# Altium schematic sheet Legendre.SchDoc
size A4
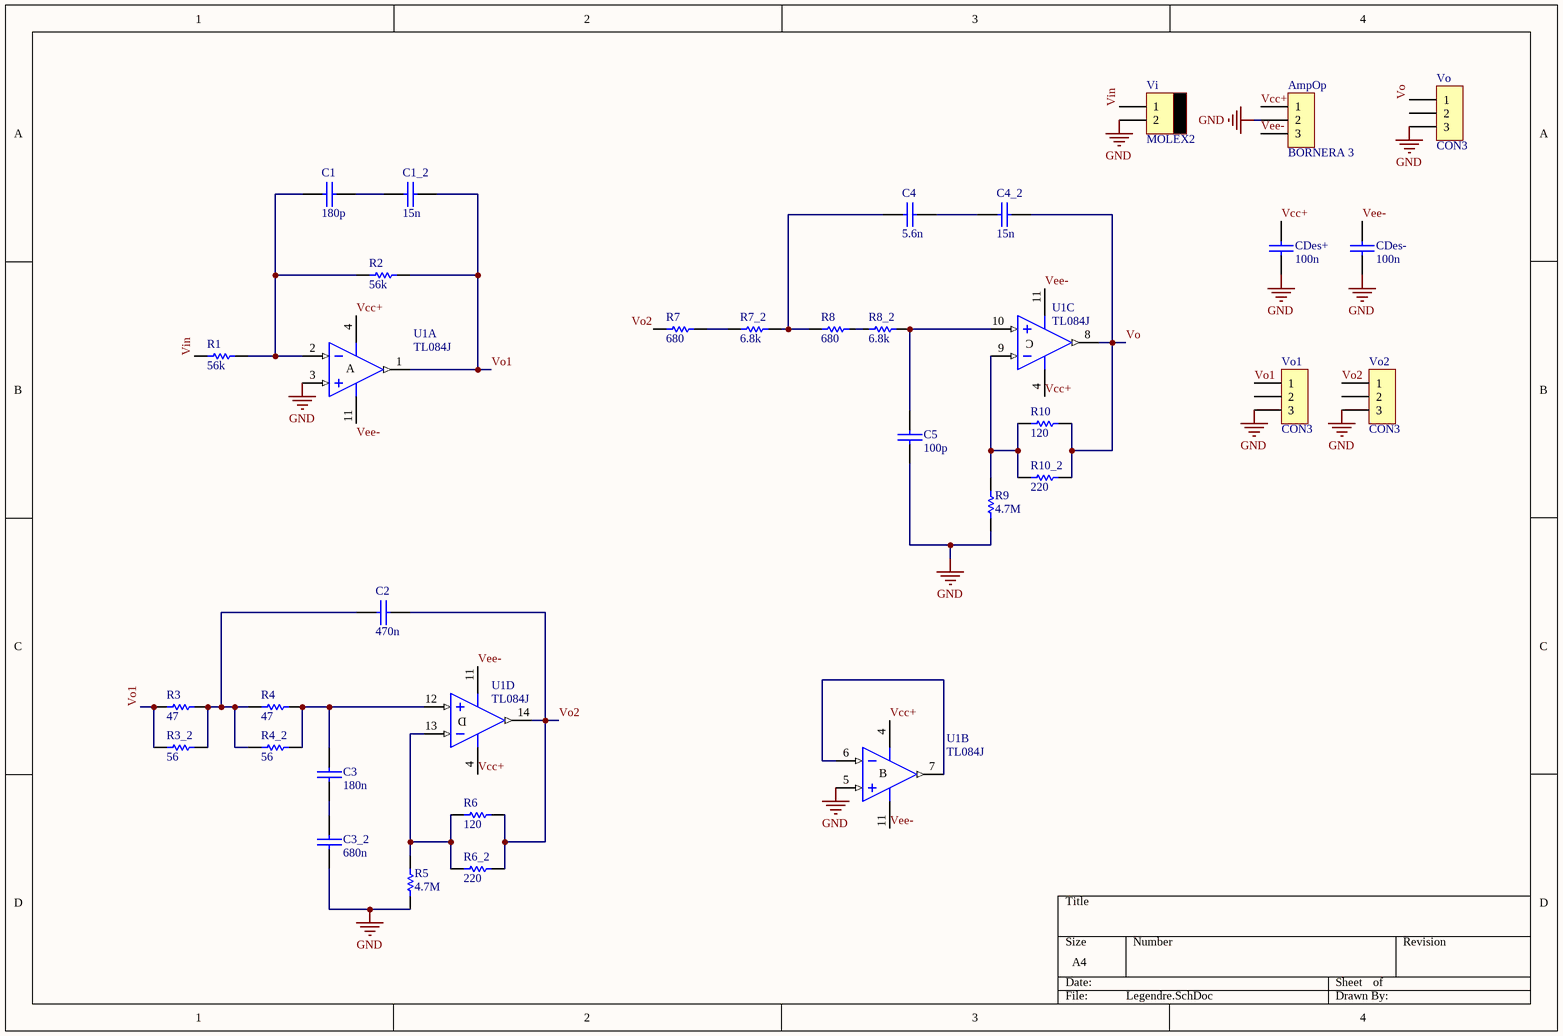
[diagram p0: Legendre.SchDoc]

## Parts
AmpOp  BORNERA 3  [BORNERA3]
C1  180p  [0805]
C1_2  15n  [0805]
C2  470n  [0805]
C3  180n  [0805]
C3_2  680n  [CAP100]
C4  5.6n  [0805]
C4_2  15n  [0805]
C5  100p  [CAP100]
CDes+  100n  [CAP100]
CDes-  100n  [CAP100]
R1  56k  [0805]
R2  56k  [0805]
R3  47  [0805]
R3_2  56  [0805]
R4  47  [0805]
R4_2  56  [0805]
R5  4.7M  [0805]
R6  120  [0805]
R6_2  220  [0805]
R7  680  [0805]
R7_2  6.8k  [0805]
R8  680  [0805]
R8_2  6.8k  [0805]
R9  4.7M  [0805]
R10  120  [0805]
R10_2  220  [0805]
U1  TL084J  [J014]  (parts A,B,C,D of 4)
Vi  MOLEX2  [MOLEX2]
Vo  CON3  [SIP3]
Vo1  CON3  [SIP3]
Vo2  CON3  [SIP3]

## Nets
GND: AmpOp.2 C3_2.2 C5.2 CDes+.2 CDes-.2 R5.1 R9.1 U1.3(IN+) U1.5(IN+) Vi.2 Vo.3 Vo1.3 Vo2.3
Vcc+: AmpOp.1 CDes+.1 U1.4(V+)
Vee-: AmpOp.3 CDes-.1 U1.11(V-)
Vin: R1.1 Vi.1
Vo: C4_2.2 R10.2 R10_2.2 U1.8(OUT) Vo.1
Vo1: C1_2.2 R2.2 R3.1 R3_2.1 U1.1(OUT) Vo1.1
Vo2: C2.2 R6.2 R6_2.2 R7.1 U1.14(OUT) Vo2.1
NetC1_1: C1.1 R1.2 R2.1 U1.2(IN-)
NetC1_2: C1.2 C1_2.1
NetC2_1: C2.1 R3.2 R3_2.2 R4.1 R4_2.1
NetC3_1: C3.1 R4.2 R4_2.2 U1.12(IN+)
NetC3_2: C3.2 C3_2.1
NetC4_1: C4.1 R7_2.2 R8.1
NetC4_2: C4.2 C4_2.1
NetC5_1: C5.1 R8_2.2 U1.10(IN+)
NetR5_2: R5.2 R6.1 R6_2.1 U1.13(IN-)
NetR7_2: R7.2 R7_2.1
NetR8_2: R8.2 R8_2.1
NetR9_2: R9.2 R10.1 R10_2.1 U1.9(IN-)
NetU1_6: U1.6(IN-) U1.7(OUT)

Not connected (* = marked no-connect by the designer): Vo 2; Vo1 2; Vo2 2

## Notes on the sheet
- (in symbol TL084J, part A) A
- (in symbol TL084J, part B) B
- (in symbol TL084J, part C) C
- (in symbol TL084J, part D) D

## Library data of the parts
C1 C1_2 C2 C3 C3_2 C4 C4_2 C5 CDes+ CDes- = CAP
R1-R3 R3_2 R4 R4_2 R5 R6 R6_2 R7 R7_2 R8 R8_2 R9 R10 R10_2 = RES
U1 = TL084J: JFET-Input Operational Amplifier; Published: 16-Jan-2001; LatestRevisionDate: 04-Mar-2005; LatestRevisionNote: Stylized 3D Model Added.; DatasheetVersion: Feb-1999; PackageVersion: Jun-1999; PackageReference: J014; Publisher: Altium Limited; PackageDescription: DIP; 14 Leads; Row Spacing 7.62 mm; Pitch 2.54 mm; ComponentLink1Description: Manufacturer Link; ComponentLink1URL: http://www.ti.com/; ComponentLink2Description: Datasheet; ComponentLink2URL: http://www-s.ti.com/sc/ds/tl084.pdf